# Altium project 2TO2.54_converter.PrjPcb
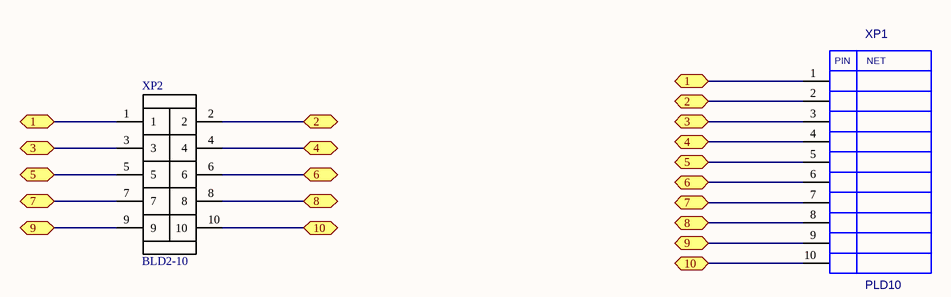
[diagram p0: Main.SchDoc]
1 sheet, 2 parts. Net scope: flat (ports and power ports of the same name join across sheets).
Board file: 2TO2.54_converter.PcbDoc

## Sheet Main.SchDoc
size A4

### Parts
XP1  PLD10  [PIN10M]
XP2  BLD2-10  [PLD2-10]

### Ports
1 (bidir), 2 (bidir), 3 (bidir), 4 (bidir), 5 (bidir), 6 (bidir), 7 (bidir), 8 (bidir), 9 (bidir), 10 (bidir)

### Nets
NetXP1_1: XP1.1 XP2.1 ; port 1
NetXP1_2: XP1.2 XP2.2 ; port 2
NetXP1_3: XP1.3 XP2.3 ; port 3
NetXP1_4: XP1.4 XP2.4 ; port 4
NetXP1_5: XP1.5 XP2.5 ; port 5
NetXP1_6: XP1.6 XP2.6 ; port 6
NetXP1_7: XP1.7 XP2.7 ; port 7
NetXP1_8: XP1.8 XP2.8 ; port 8
NetXP1_9: XP1.9 XP2.9 ; port 9
NetXP1_10: XP1.10 XP2.10 ; port 10

### Notes on the sheet
- (in symbol PLD10) PIN; NET

### Library data of the parts
XP2 = PLD2-10: Value: BLD2-10
XP1 = PLD10: Value: *